# EasyEDA schematic Interspec- V0.1.json

## Sheets
1 Decoder & Clock Gen: TITLE: Interspec - Decoder, Simple Ports & Clock Gen; REV: 0.1; Date: 27-01-2024; Sheet: 1/2
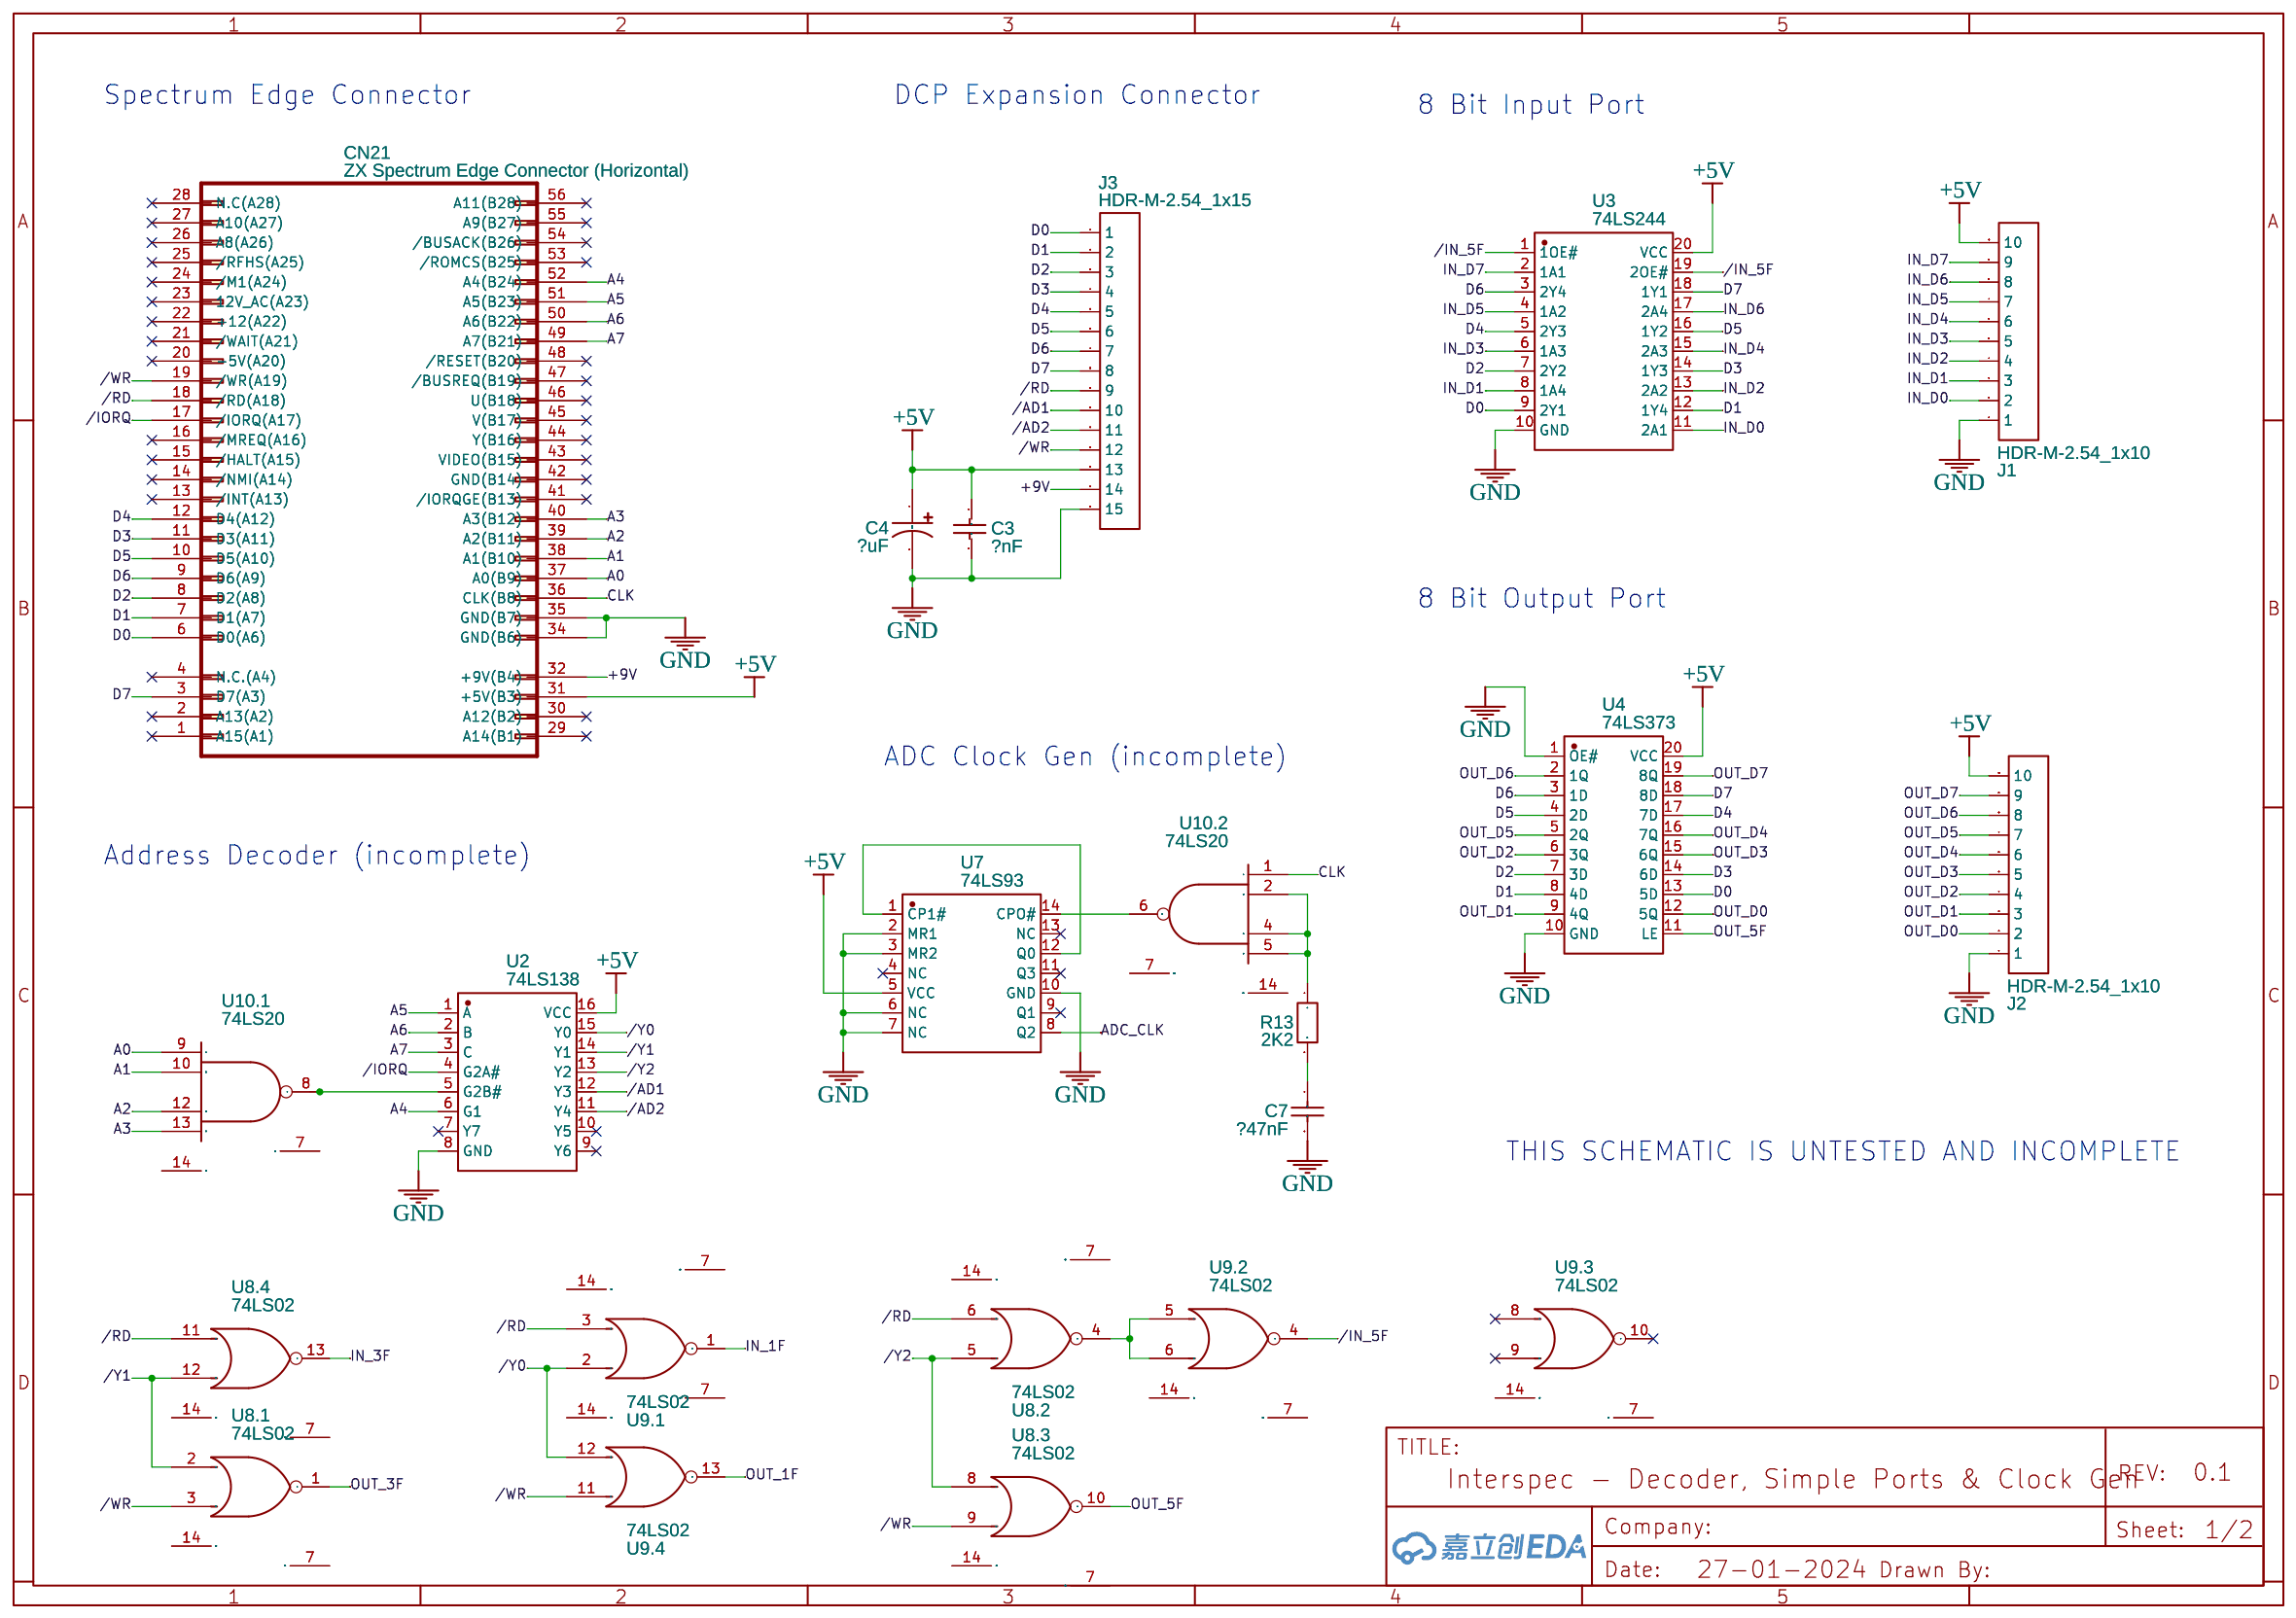
[diagram p0: Decoder & Clock Gen]
2 ADC & Ports: TITLE: Interspec - ADC, Switch Inputs & Relay Outputs; Sheet: 2/2
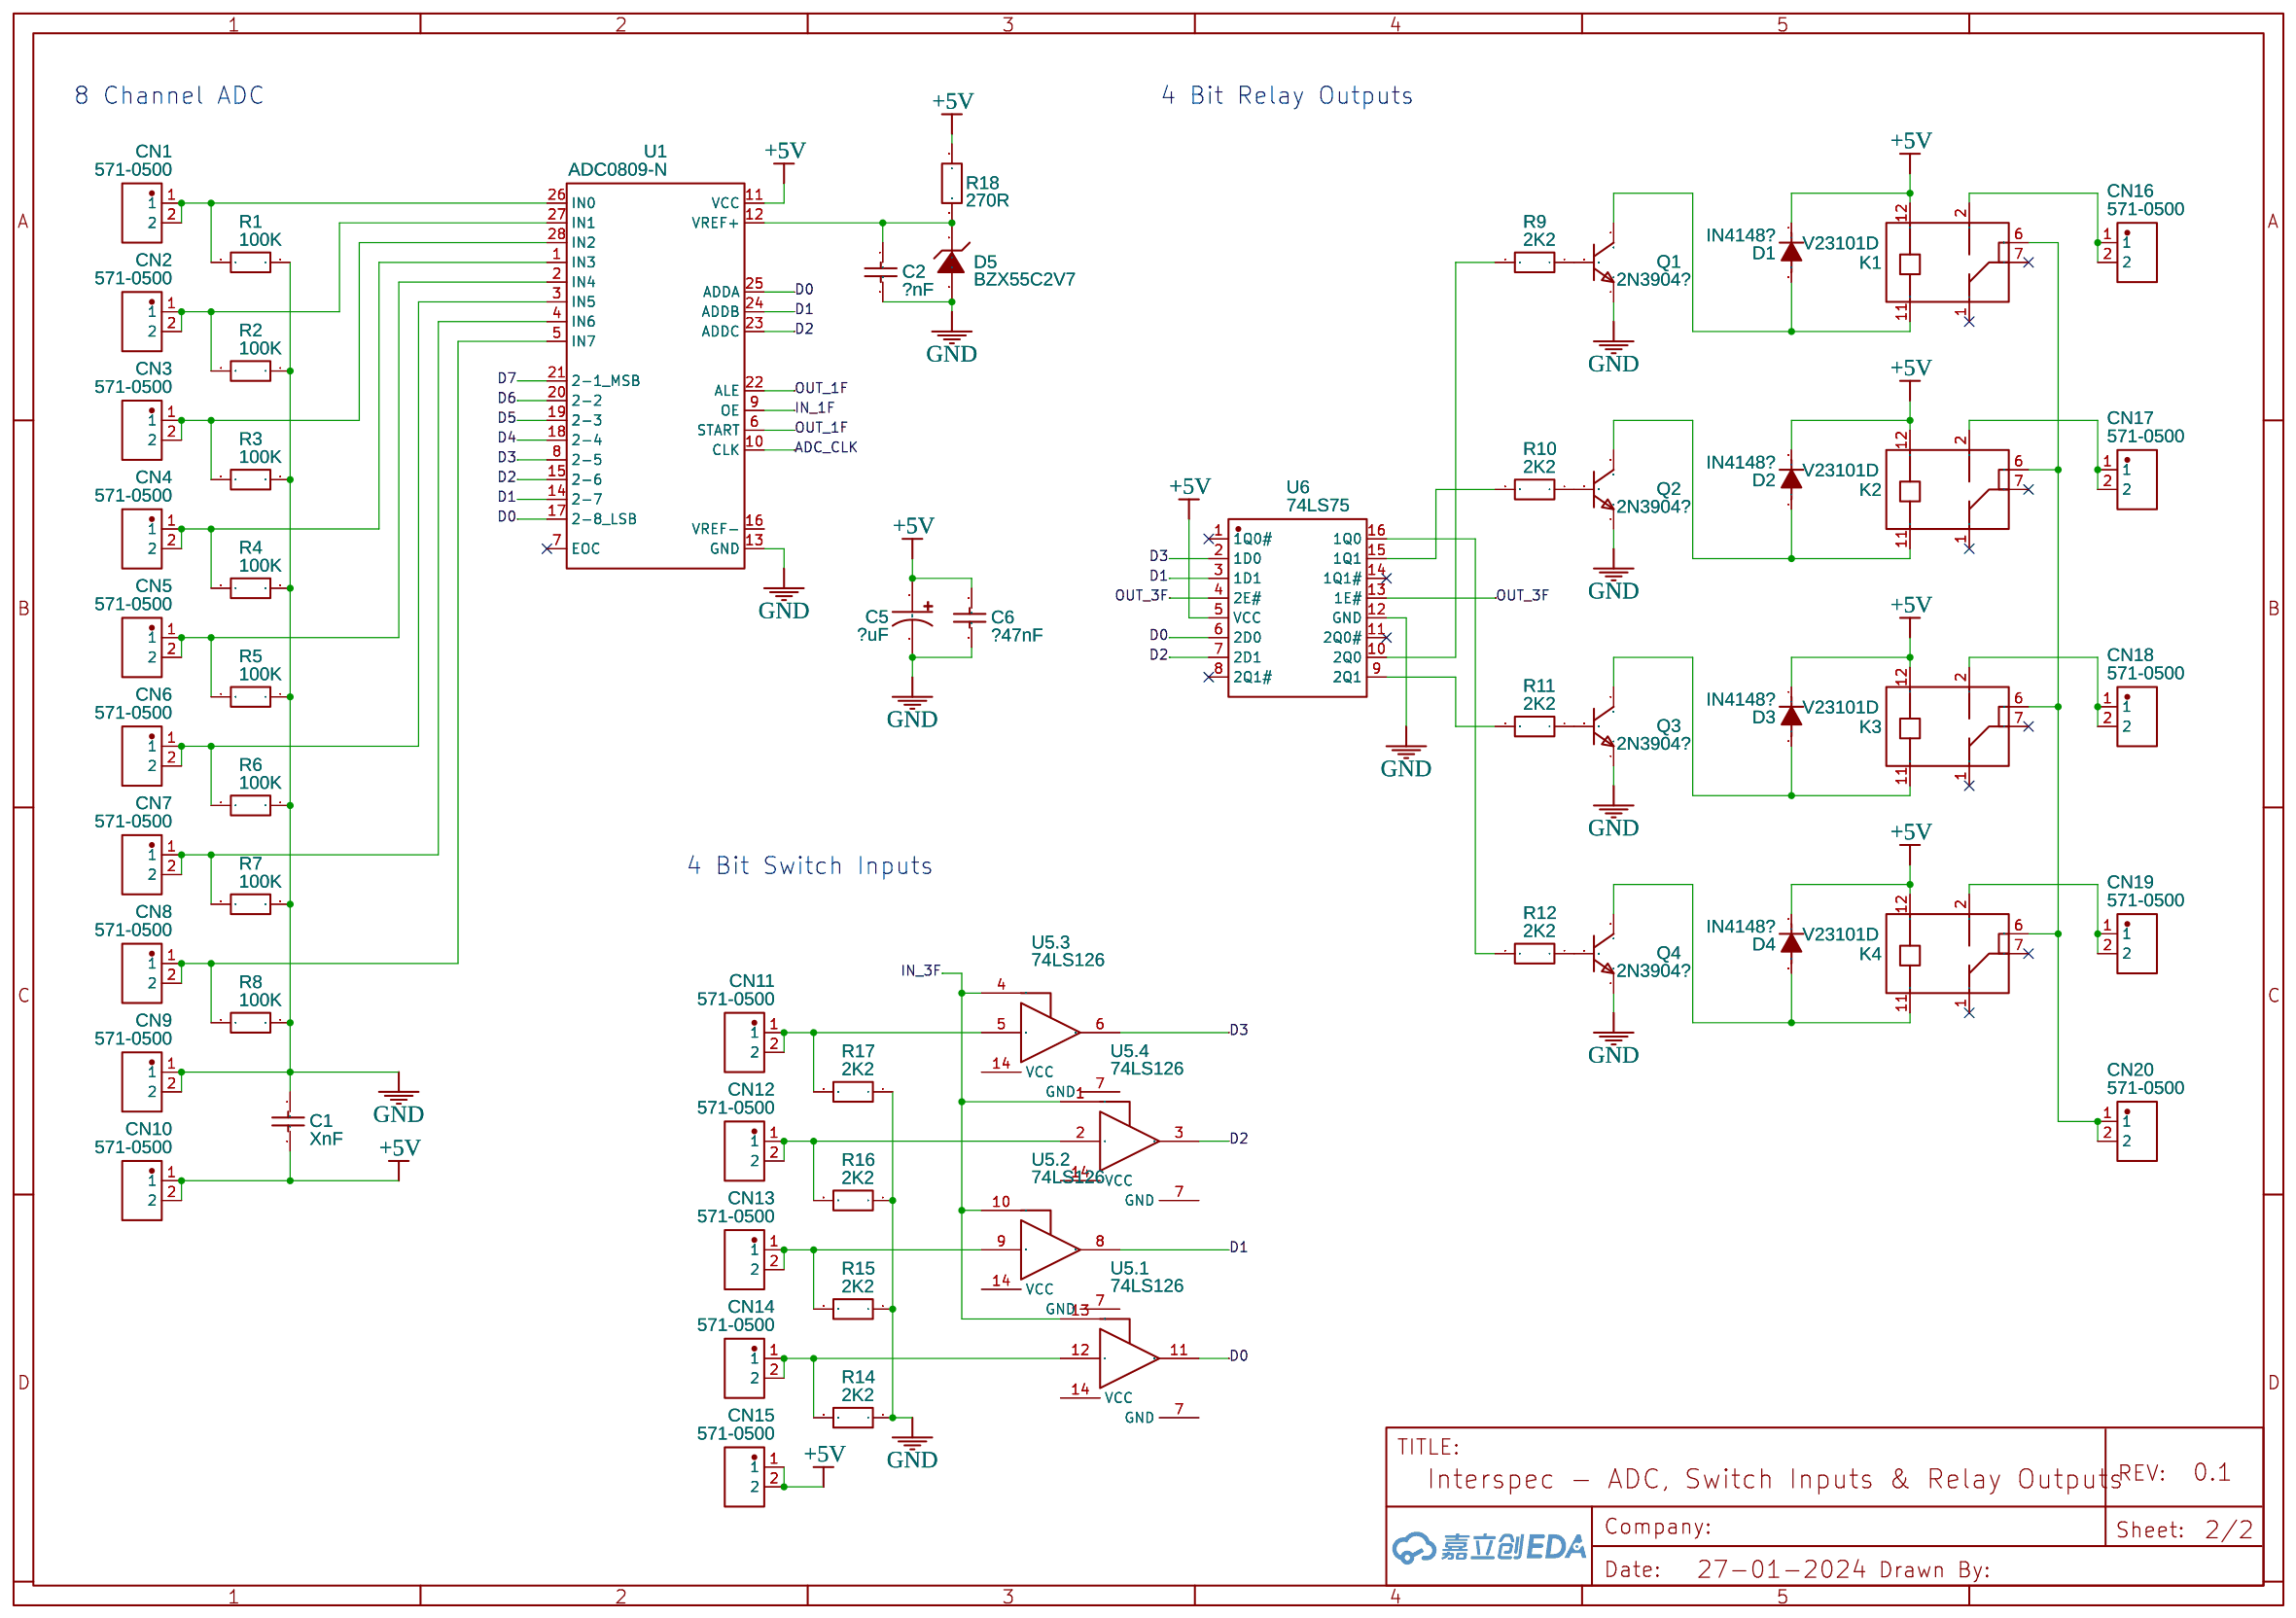
[diagram p1: ADC & Ports]

## Parts
sheet ADC & Ports
C1  XnF  [CAP-TH_L5.5-W3.5-P2.50-D0.5 COPY]
C2  ?nF  [CAP-TH_L5.5-W3.5-P2.50-D0.5 COPY]
C5  ?uF  [CAP-TH_BD6.3-P2.50-D1.0-FD]
C6  ?47nF  [CAP-TH_L5.5-W3.5-P2.50-D0.5 COPY]
CN1  571-0500  [CONN-TH_571-0500]
CN2  571-0500  [CONN-TH_571-0500]
CN3  571-0500  [CONN-TH_571-0500]
CN4  571-0500  [CONN-TH_571-0500]
CN5  571-0500  [CONN-TH_571-0500]
CN6  571-0500  [CONN-TH_571-0500]
CN7  571-0500  [CONN-TH_571-0500]
CN8  571-0500  [CONN-TH_571-0500]
CN9  571-0500  [CONN-TH_571-0500]
CN10  571-0500  [CONN-TH_571-0500]
CN11  571-0500  [CONN-TH_571-0500]
CN12  571-0500  [CONN-TH_571-0500]
CN13  571-0500  [CONN-TH_571-0500]
CN14  571-0500  [CONN-TH_571-0500]
CN15  571-0500  [CONN-TH_571-0500]
CN16  571-0500  [CONN-TH_571-0500]
CN17  571-0500  [CONN-TH_571-0500]
CN18  571-0500  [CONN-TH_571-0500]
CN19  571-0500  [CONN-TH_571-0500]
CN20  571-0500  [CONN-TH_571-0500]
D1  IN4148?  [IN4148]
D2  IN4148?  [IN4148]
D3  IN4148?  [IN4148]
D4  IN4148?  [IN4148]
D5  BZX55C2V7  [DO-35_BD2.0-L4.0-P8.00-D0.5-FD]
K1  V23101D  [RELAY-TH_TE_V23101-D0XXX-BXXX]
K2  V23101D  [RELAY-TH_TE_V23101-D0XXX-BXXX]
K3  V23101D  [RELAY-TH_TE_V23101-D0XXX-BXXX]
K4  V23101D  [RELAY-TH_TE_V23101-D0XXX-BXXX]
Q1  2N3904?  [TO-92-3_L4.8-W3.7-P2.54-L]
Q2  2N3904?  [TO-92-3_L4.8-W3.7-P2.54-L]
Q3  2N3904?  [TO-92-3_L4.8-W3.7-P2.54-L]
Q4  2N3904?  [TO-92-3_L4.8-W3.7-P2.54-L]
R1  100K  [R_AXIAL-0.3 COPY]
R2  100K  [R_AXIAL-0.3 COPY]
R3  100K  [R_AXIAL-0.3 COPY]
R4  100K  [R_AXIAL-0.3 COPY]
R5  100K  [R_AXIAL-0.3 COPY]
R6  100K  [R_AXIAL-0.3 COPY]
R7  100K  [R_AXIAL-0.3 COPY]
R8  100K  [R_AXIAL-0.3 COPY]
R9  2K2  [R_AXIAL-0.3 COPY]
R10  2K2  [R_AXIAL-0.3 COPY]
R11  2K2  [R_AXIAL-0.3 COPY]
R12  2K2  [R_AXIAL-0.3 COPY]
R14  2K2  [R_AXIAL-0.3 COPY]
R15  2K2  [R_AXIAL-0.3 COPY]
R16  2K2  [R_AXIAL-0.3 COPY]
R17  2K2  [R_AXIAL-0.3 COPY]
R18  270R  [R_AXIAL-0.3 COPY]
U1  ADC0809-N  [PDIP-28_L36.0-W13.0-P2.54-LS15.5-BL]
U5  74LS126  [DIP14]  (sections 1,2,3,4)
U6  74LS75  [PDIP-16_L19.7-W6.6-P2.54-LS7.6-BL]
sheet Decoder & Clock Gen
C3  ?nF  [CAP-TH_L5.5-W3.5-P2.50-D0.5 COPY]
C4  ?uF  [CAP-TH_BD6.3-P2.50-D1.0-FD]
C7  ?47nF  [CAP-TH_L5.5-W3.5-P2.50-D0.5 COPY]
CN21  ZX Spectrum Edge Connector (Horizontal)  [ZX SPECTRUM EDGE CONNECTOR (HORIZONTAL)]
J1  HDR-M-2.54_1x10  [HDR-M-2.54_1X10]
J2  HDR-M-2.54_1x10  [HDR-M-2.54_1X10]
J3  HDR-M-2.54_1x15  [HDR-M-2.54_1X15]
R13  2K2  [R_AXIAL-0.3 COPY]
U2  74LS138  [PDIP-16_L19.7-W6.6-P2.54-LS7.6-BL]
U3  74LS244  [DIP-20_L26.8-W6.4-P2.54-LS7.6-BL]
U4  74LS373  [PDIP-20_L25.4-W6.4-P2.54-LS7.6-BL]
U7  74LS93  [PDIP-14_L19.3-W6.4-P2.54-LS8.0-BL]
U8  74LS02  [DIP14]  (sections 1,2,3,4)
U9  74LS02  [DIP14]  (sections 1,2,3,4)
U10  74LS20  [DIP14]  (sections 1,2)

## Library data of the parts
C1-C3 C6 C7 = 100nF (104) ±20% 100V: Supplier: LCSC; Manufacturer: ReliaPro; Supplier Part: C72322
C4 C5 = KM1H470ME110A00CV0: Supplier: LCSC; Supplier Part: C190654; Manufacturer: Changzhou Huawei Elec; Contributor: LCSC; JLCPCB Part Class: Extended Part
CN1-CN20 = 571-0500: Contributor: lcsc; Supplier: LCSC; Supplier Part: C9900007300; Manufacturer: null; JLCPCB Part Class: Extended Part
D1-D4 = IN4148: Contributor: GrahamG
D5 = BZX55C2V7: Supplier: LCSC; Manufacturer: ST(先科); Supplier Part: C2505; JLCPCB Part Class: Extended Part
K1-K4 = V23101D 5B201: Contributor: LCSC; Supplier: LCSC; Supplier Part: C1560994; Manufacturer: TE Connectivity(美国泰科); JLCPCB Part Class: Extended Part
Q1-Q4 = 2N3904TFR: Supplier: LCSC; Supplier Part: C258185; Manufacturer: ON Semicon; Contributor: LCSC; JLCPCB Part Class: Extended Part
R1-R18 = R_AXIAL-0.3_EU: Contributor: LCEDA_Lib
U1 = ADC0809-N: Contributor: lcsc; Supplier: LCSC; Supplier Part: C9900042594; Manufacturer: null
U5 = HD74HC126P: Quad Bus Buffer Gates with 3-State Outputs; subpart_no: 1
U6 = CD74HC75E: Contributor: LCSC; Supplier: LCSC; Supplier Part: C1523303; Manufacturer: TI(德州仪器); JLCPCB Part Class: Extended Part
CN21 = ZX Spectrum Edge Connector (Horizontal): Contributor: Benin
J1 J2 = HDR-M-2.54_1x10: Supplier Part: C57369; Supplier: LCSC; Contributor: LCEDA_Lib
J3 = HDR-M-2.54_1x15: Supplier Part: C124373; Supplier: LCSC; Contributor: LCEDA_Lib
U2 = 74HC138AD: Contributor: lcsc; Supplier: LCSC; Supplier Part: C5274768; Manufacturer: Sungine(双竞集成)
U3 = SN74HC244N: Supplier: LCSC; Manufacturer: TI(德州仪器); Supplier Part: C2912; JLCPCB Part Class: Extended Part
U4 = SN74HC373AN: Contributor: lcsc; Supplier: LCSC; Supplier Part: C2865577; Manufacturer: TI(德州仪器)
U7 = CD74HC93E: Contributor: LCSC; Supplier: LCSC; Supplier Part: C1547940; Manufacturer: TI(德州仪器); JLCPCB Part Class: Extended Part
U8 U9 = MC74HC02AN: Quad 2-Input NOR Gate; subpart_no: 1
U10 = MC74HC20N: Dual 4-Input NAND Gate; subpart_no: 1

## Nets
+5V: C1.2 C3.1 C4.1 C5.1 C6.1 CN10.1 CN10.2 CN15.1 CN15.2 CN21.31(+5V(B3)) D1.1(-) D2.1(-) D3.1(-) D4.1(-) J1.10 J2.10 J3.13 K1.12(2) K2.12(2) K3.12(2) K4.12(2) R18.1 U1.11(VCC) U2.16(VCC) U3.20(VCC) U4.20(VCC) U6.5(VCC) U7.5(VCC)
+9V: CN21.32(+9V(B4)) J3.14
GND: C1.1 C2.2 C3.2 C4.2 C5.2 C6.2 C7.2 CN9.1 CN9.2 CN21.34(GND(B6)) CN21.35(GND(B7)) D5.1(A) J1.1 J2.1 J3.15 Q1.1(E) Q2.1(E) Q3.1(E) Q4.1(E) R1.1 R2.1 R3.1 R4.1 R5.1 R6.1 R7.1 R8.1 R14.1 R15.1 R16.1 R17.1 U1.13(GND) U2.8(GND) U3.10(GND) U4.1(OE#) U4.10(GND) U6.12(GND) U7.2(MR1) U7.3(MR2) U7.6(NC) U7.7(NC) U7.10(GND)
/AD1: J3.10 U2.12(Y3)
/AD2: J3.11 U2.11(Y4)
/IN_5F: U3.1(1OE#) U3.19(2OE#) U9.4(Y)
/IORQ: CN21.17(/IORQ(A17)) U2.4(G2A#)
/RD: CN21.18(/RD(A18)) J3.9 U8.6(B) U8.11(A) U9.3(B)
/WR: CN21.19(/WR(A19)) J3.12 U8.3(B) U8.9(B) U9.11(A)
/Y0: U2.15(Y0) U9.2(A) U9.12(B)
/Y1: U2.14(Y1) U8.2(A) U8.12(B)
/Y2: U2.13(Y2) U8.5(A) U8.8(A)
A0: CN21.37(A0(B9)) U10.9(A)
A1: CN21.38(A1(B10)) U10.10(B)
A2: CN21.39(A2(B11)) U10.12(C)
A3: CN21.40(A3(B12)) U10.13(D)
A4: CN21.52(A4(B24)) U2.6(G1)
A5: CN21.51(A5(B23)) U2.1(A)
A6: CN21.50(A6(B22)) U2.2(B)
A7: CN21.49(A7(B21)) U2.3(C)
ADC_CLK: U1.10(CLK) U7.8(Q2)
CLK: CN21.36(CLK(B8)) U10.1(A)
D0: CN21.6(D0(A6)) J3.1 U1.17(2-8_LSB) U1.25(ADDA) U3.9(2Y1) U4.13(5D) U5.11(4Y) U6.6(2D0)
D1: CN21.7(D1(A7)) J3.2 U1.14(2-7) U1.24(ADDB) U3.12(1Y4) U4.8(4D) U5.8(3Y) U6.3(1D1)
D2: CN21.8(D2(A8)) J3.3 U1.15(2-6) U1.23(ADDC) U3.7(2Y2) U4.7(3D) U5.3(1Y) U6.7(2D1)
D3: CN21.11(D3(A11)) J3.4 U1.8(2-5) U3.14(1Y3) U4.14(6D) U5.6(2Y) U6.2(1D0)
D4: CN21.12(D4(A12)) J3.5 U1.18(2-4) U3.5(2Y3) U4.17(7D)
D5: CN21.10(D5(A10)) J3.6 U1.19(2-3) U3.16(1Y2) U4.4(2D)
D6: CN21.9(D6(A9)) J3.7 U1.20(2-2) U3.3(2Y4) U4.3(1D)
D7: CN21.3(D7(A3)) J3.8 U1.21(2-1_MSB) U3.18(1Y1) U4.18(8D)
IN_1F: U1.9(OE) U9.1(Y)
IN_3F: U5.1(1C) U5.4(2C) U5.10(3C) U5.13(4C) U8.13(Y)
IN_D0: J1.2 U3.11(2A1)
IN_D1: J1.3 U3.8(1A4)
IN_D2: J1.4 U3.13(2A2)
IN_D3: J1.5 U3.6(1A3)
IN_D4: J1.6 U3.15(2A3)
IN_D5: J1.7 U3.4(1A2)
IN_D6: J1.8 U3.17(2A4)
IN_D7: J1.9 U3.2(1A1)
OUT_1F: U1.6(START) U1.22(ALE) U9.13(Y)
OUT_3F: U6.4(2E#) U6.13(1E#) U8.1(Y)
OUT_5F: U4.11(LE) U8.10(Y)
OUT_D0: J2.2 U4.12(5Q)
OUT_D1: J2.3 U4.9(4Q)
OUT_D2: J2.4 U4.6(3Q)
OUT_D3: J2.5 U4.15(6Q)
OUT_D4: J2.6 U4.16(7Q)
OUT_D5: J2.7 U4.5(2Q)
OUT_D6: J2.8 U4.2(1Q)
OUT_D7: J2.9 U4.19(8Q)
Net-(C2-1): C2.1 D5.2(K) R18.2 U1.12(VREF+)
Net-(C7-1): C7.1 R13.2
Net-(CN1-1): CN1.1 CN1.2 R1.2 U1.26(IN0)
Net-(CN2-1): CN2.1 CN2.2 R2.2 U1.27(IN1)
Net-(CN3-1): CN3.1 CN3.2 R3.2 U1.28(IN2)
Net-(CN4-1): CN4.1 CN4.2 R4.2 U1.1(IN3)
Net-(CN5-1): CN5.1 CN5.2 R5.2 U1.2(IN4)
Net-(CN6-1): CN6.1 CN6.2 R6.2 U1.3(IN5)
Net-(CN7-1): CN7.1 CN7.2 R7.2 U1.4(IN6)
Net-(CN8-1): CN8.1 CN8.2 R8.2 U1.5(IN7)
Net-(CN11-1): CN11.1 CN11.2 R17.2 U5.5(2A)
Net-(CN12-1): CN12.1 CN12.2 R16.2 U5.2(1A)
Net-(CN13-1): CN13.1 CN13.2 R15.2 U5.9(3A)
Net-(CN14-1): CN14.1 CN14.2 R14.2 U5.12(4A)
Net-(CN16-1): CN16.1 CN16.2 K1.2
Net-(CN17-1): CN17.1 CN17.2 K2.2
Net-(CN18-1): CN18.1 CN18.2 K3.2
Net-(CN19-1): CN19.1 CN19.2 K4.2
Net-(CN20-1): CN20.1 CN20.2 K1.6 K2.6 K3.6 K4.6
Net-(D1-2): D1.2(+) K1.11 Q1.3(C)
Net-(D2-2): D2.2(+) K2.11 Q2.3(C)
Net-(D3-2): D3.2(+) K3.11 Q3.3(C)
Net-(D4-2): D4.2(+) K4.11 Q4.3(C)
Net-(Q1-2): Q1.2(B) R9.1
Net-(Q2-2): Q2.2(B) R10.1
Net-(Q3-2): Q3.2(B) R11.1
Net-(Q4-2): Q4.2(B) R12.1
Net-(R9-2): R9.2 U6.10(2Q0)
Net-(R10-2): R10.2 U6.15(1Q1)
Net-(R11-2): R11.2 U6.9(2Q1)
Net-(R12-2): R12.2 U6.16(1Q0)
Net-(R13-1): R13.1 U10.2(B) U10.4(C) U10.5(D)
Net-(U2-5): U2.5(G2B#) U10.8(Y)
Net-(U7-1): U7.1(CP1#) U7.12(Q0)
Net-(U7-14): U7.14(CPO#) U10.6(Y)
Net-(U8.2-4): U8.4(Y) U9.5(A) U9.6(B)

Not connected (* = marked no-connect by the designer): CN21 1(A15(A1))* 2(A13(A2))* 4(N.C.(A4))* 13(/INT(A13))* 14(/NMI(A14))* 15(/HALT(A15))* 16(/MREQ(A16))* 20(-5V(A20))* 21(/WAIT(A21))* 22(+12(A22))* 23(12V AC(A23))* 24(/M1(A24))* 25(/RFHS(A25))* 26(A8(A26))* 27(A10(A27))* 28(N.C(A28))* 29(A14(B1))* 30(A12(B2))* 41(/IORQGE(B13))* 42(GND(B14))* 43(VIDEO(B15))* 44(Y(B16))* 45(V(B17))* 46(U(B18))* 47(/BUSREQ(B19))* 48(/RESET(B20))* 53(/ROMCS(B25))* 54(/BUSACK(B26))* 55(A9(B27))* 56(A11(B28))*; K1 1* 7*; K2 1* 7*; K3 1* 7*; K4 1* 7*; U1 7(EOC)* 16(VREF-); U2 7(Y7)* 9(Y6)* 10(Y5)*; U5 7(GND) 14(VCC); U6 1(1Q0#)* 8(2Q1#)* 11(2Q0#)* 14(1Q1#)*; U7 4(NC)* 9(Q1)* 11(Q3)* 13(NC)*; U8 7(GND) 14(VCC); U9 7(GND) 8(A)* 9(B)* 10(Y)* 14(VCC); U10 7(GND) 14(VDD)

## Notes on the sheets
sheet 1
- Spectrum Edge Connector
- DCP Expansion Connector
- 8 Bit Input Port
- 8 Bit Output Port
- ADC Clock Gen (incomplete)
- Address Decoder (incomplete)
- THIS SCHEMATIC IS UNTESTED AND INCOMPLETE
sheet 2
- 8 Channel ADC
- 4 Bit Relay Outputs
- 4 Bit Switch Inputs
